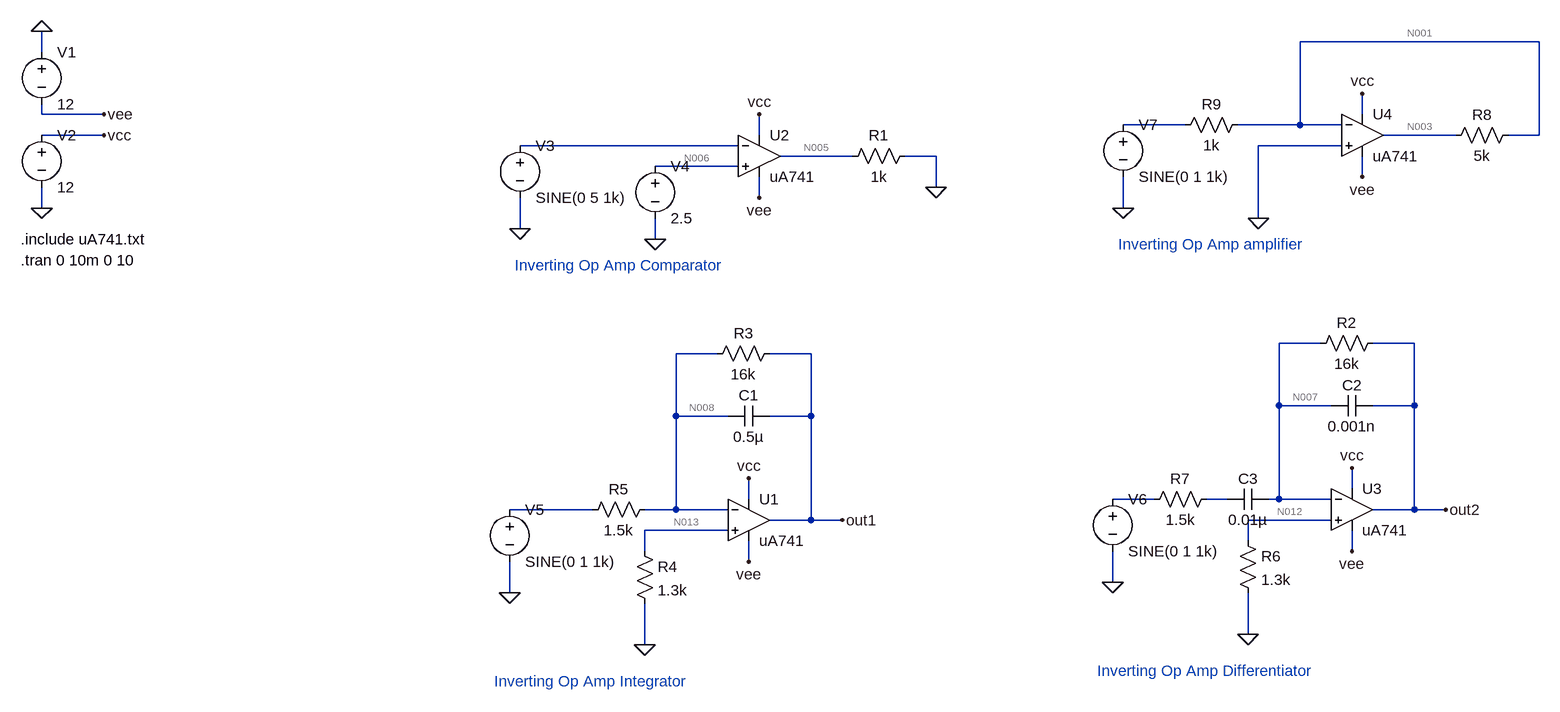
[diagram p0: schematic comparator_amp_diff_integrator.asc]
comparator_amp_diff_integrator.asc, the LTspice schematic file:
Version 4
SHEET 1 1348 1032
WIRE 1328 32 960 32
WIRE -976 48 -976 16
WIRE -976 144 -976 128
WIRE -880 144 -976 144
WIRE 1056 144 1056 112
WIRE 784 160 688 160
WIRE 960 160 960 32
WIRE 960 160 864 160
WIRE 1024 160 960 160
WIRE -880 176 -976 176
WIRE 128 176 128 144
WIRE 1200 176 1088 176
WIRE 1328 176 1328 32
WIRE 1328 176 1280 176
WIRE 96 192 -240 192
WIRE 1024 192 896 192
WIRE 272 208 160 208
WIRE 400 208 352 208
WIRE 96 224 -32 224
WIRE 1056 240 1056 208
WIRE 400 256 400 208
WIRE 128 272 128 240
WIRE -976 288 -976 256
WIRE 688 288 688 240
WIRE 896 304 896 192
WIRE -240 320 -240 272
WIRE -32 336 -32 304
WIRE 992 496 928 496
WIRE 1136 496 1072 496
WIRE 64 512 0 512
WIRE 208 512 144 512
WIRE 928 592 928 496
WIRE 1008 592 928 592
WIRE 1136 592 1136 496
WIRE 1136 592 1072 592
WIRE 0 608 0 512
WIRE 80 608 0 608
WIRE 208 608 208 512
WIRE 208 608 144 608
WIRE 1040 720 1040 688
WIRE 112 736 112 704
WIRE 736 736 672 736
WIRE 848 736 816 736
WIRE 928 736 928 592
WIRE 928 736 912 736
WIRE 1008 736 928 736
WIRE -128 752 -256 752
WIRE 0 752 0 608
WIRE 0 752 -48 752
WIRE 80 752 0 752
WIRE 1136 752 1136 592
WIRE 1136 752 1072 752
WIRE 1184 752 1136 752
WIRE 208 768 208 608
WIRE 208 768 144 768
WIRE 256 768 208 768
WIRE 1008 768 880 768
WIRE 80 784 -48 784
WIRE 880 800 880 768
WIRE -48 816 -48 784
WIRE 1040 816 1040 784
WIRE 112 832 112 800
WIRE 672 864 672 816
WIRE -256 880 -256 832
WIRE 880 944 880 880
WIRE -48 960 -48 896
FLAG -976 288 0
FLAG -976 16 0
FLAG -880 176 vcc
FLAG -880 144 vee
FLAG 128 144 vcc
FLAG 128 272 vee
FLAG 400 256 0
FLAG -240 320 0
FLAG -32 336 0
FLAG 112 704 vcc
FLAG 112 832 vee
FLAG -256 880 0
FLAG -48 960 0
FLAG 256 768 out1
FLAG 1040 688 vcc
FLAG 1040 816 vee
FLAG 672 864 0
FLAG 880 944 0
FLAG 1184 752 out2
FLAG 1056 112 vcc
FLAG 1056 240 vee
FLAG 688 288 0
FLAG 896 304 0
SYMBOL OpAmps\\opamp2 128 144 R0
SYMATTR InstName U2
SYMATTR Value uA741
SYMBOL voltage -976 32 R0
WINDOW 123 0 0 Left 0
WINDOW 39 0 0 Left 0
SYMATTR InstName V1
SYMATTR Value 12
SYMBOL voltage -976 160 R0
WINDOW 123 0 0 Left 0
WINDOW 39 0 0 Left 0
SYMATTR InstName V2
SYMATTR Value 12
SYMBOL voltage -240 176 R0
WINDOW 123 0 0 Left 0
WINDOW 39 0 0 Left 0
SYMATTR InstName V3
SYMATTR Value SINE(0 5 1k)
SYMBOL voltage -32 208 R0
WINDOW 123 0 0 Left 0
WINDOW 39 0 0 Left 0
SYMATTR InstName V4
SYMATTR Value 2.5
SYMBOL res 368 192 R90
WINDOW 0 0 56 VBottom 2
WINDOW 3 32 56 VTop 2
SYMATTR InstName R1
SYMATTR Value 1k
SYMBOL OpAmps\\opamp2 112 704 R0
SYMATTR InstName U1
SYMATTR Value uA741
SYMBOL voltage -256 736 R0
WINDOW 123 0 0 Left 0
WINDOW 39 0 0 Left 0
SYMATTR InstName V5
SYMATTR Value SINE(0 1 1k)
SYMBOL cap 144 592 R90
WINDOW 0 0 32 VBottom 2
WINDOW 3 32 32 VTop 2
SYMATTR InstName C1
SYMATTR Value 0.5µ
SYMBOL res 160 496 R90
WINDOW 0 0 56 VBottom 2
WINDOW 3 32 56 VTop 2
SYMATTR InstName R3
SYMATTR Value 16k
SYMBOL res -64 800 R0
SYMATTR InstName R4
SYMATTR Value 1.3k
SYMBOL res -32 736 R90
WINDOW 0 0 56 VBottom 2
WINDOW 3 32 56 VTop 2
SYMATTR InstName R5
SYMATTR Value 1.5k
SYMBOL OpAmps\\opamp2 1040 688 R0
SYMATTR InstName U3
SYMATTR Value uA741
SYMBOL voltage 672 720 R0
WINDOW 123 0 0 Left 0
WINDOW 39 0 0 Left 0
SYMATTR InstName V6
SYMATTR Value SINE(0 1 1k)
SYMBOL cap 1072 576 R90
WINDOW 0 0 32 VBottom 2
WINDOW 3 32 32 VTop 2
SYMATTR InstName C2
SYMATTR Value 0.001n
SYMBOL res 1088 480 R90
WINDOW 0 0 56 VBottom 2
WINDOW 3 32 56 VTop 2
SYMATTR InstName R2
SYMATTR Value 16k
SYMBOL res 864 784 R0
SYMATTR InstName R6
SYMATTR Value 1.3k
SYMBOL res 832 720 R90
WINDOW 0 0 56 VBottom 2
WINDOW 3 32 56 VTop 2
SYMATTR InstName R7
SYMATTR Value 1.5k
SYMBOL cap 912 720 R90
WINDOW 0 0 32 VBottom 2
WINDOW 3 32 32 VTop 2
SYMATTR InstName C3
SYMATTR Value 0.01µ
SYMBOL OpAmps\\opamp2 1056 112 R0
SYMATTR InstName U4
SYMATTR Value uA741
SYMBOL voltage 688 144 R0
WINDOW 123 0 0 Left 0
WINDOW 39 0 0 Left 0
SYMATTR InstName V7
SYMATTR Value SINE(0 1 1k)
SYMBOL res 1296 160 R90
WINDOW 0 0 56 VBottom 2
WINDOW 3 32 56 VTop 2
SYMATTR InstName R8
SYMATTR Value 5k
SYMBOL res 880 144 R90
WINDOW 0 0 56 VBottom 2
WINDOW 3 32 56 VTop 2
SYMATTR InstName R9
SYMATTR Value 1k
TEXT -1008 368 Left 2 !.tran 0 10m 0 10
TEXT -1008 336 Left 2 !.include uA741.txt
TEXT -248 376 Left 2 ;Inverting Op Amp Comparator
TEXT -280 1016 Left 2 ;Inverting Op Amp Integrator
TEXT 648 1000 Left 2 ;Inverting Op Amp Differentiator
TEXT 680 344 Left 2 ;Inverting Op Amp amplifier

The netlist it stands for:
* comparator_amp_diff_integrator.asc
XU2 N006 N004 vcc vee N005 uA741  ; pins In+ In- V+ V- OUT
V1 0 vee 12
V2 vcc 0 12
V3 N004 0 SINE(0 5 1k)
V4 N006 0 2.5
R1 0 N005 1k
XU1 N013 N008 vcc vee out1 uA741  ; pins In+ In- V+ V- OUT
V5 N011 0 SINE(0 1 1k)
C1 out1 N008 0.5µ
R3 out1 N008 16k
R4 N013 0 1.3k
R5 N008 N011 1.5k
XU3 N012 N007 vcc vee out2 uA741  ; pins In+ In- V+ V- OUT
V6 N009 0 SINE(0 1 1k)
C2 out2 N007 0.001n
R2 out2 N007 16k
R6 N012 0 1.3k
R7 N010 N009 1.5k
C3 N007 N010 0.01µ
XU4 0 N001 vcc vee N003 uA741  ; pins In+ In- V+ V- OUT
V7 N002 0 SINE(0 1 1k)
R8 N001 N003 5k
R9 N001 N002 1k
.tran 0 10m 0 10
.include uA741.txt
* Inverting Op Amp Comparator
* Inverting Op Amp Integrator
* Inverting Op Amp Differentiator
* Inverting Op Amp amplifier
.backanno
.end

* Results of the author's LTspice run, read from the files saved beside the schematic
* Operating Point, zero values left out:
*   V(n005) = 10.01 V
*   V(vee) = -12 V
*   V(vcc) = 12 V
*   V(n006) = 2.5 V
*   V(out1) = 197.3 µV
*   V(n008) = -92.47 µV
*   V(n013) = -103.7 µV
*   V(out2) = 1.184 mV
*   V(n007) = -92.48 µV
*   V(n012) = -103.7 µV
*   V(n003) = 465.9 µV
*   V(n001) = 11.18 µV
*   I(R9) = 11.18 nA
*   I(R8) = -90.94 nA
*   I(R6) = -79.74 nA
*   I(R2) = 79.76 nA
*   I(R5) = -61.65 nA
*   I(R4) = -79.74 nA
*   I(R3) = 18.11 nA
*   I(R1) = -10.01 mA
*   I(V7) = 11.18 nA
*   I(V5) = -61.65 nA
*   I(V4) = -161.5 nA
*   I(V3) = 13.87 pA
*   I(V2) = -5.329 mA
*   I(V1) = -5.342 mA
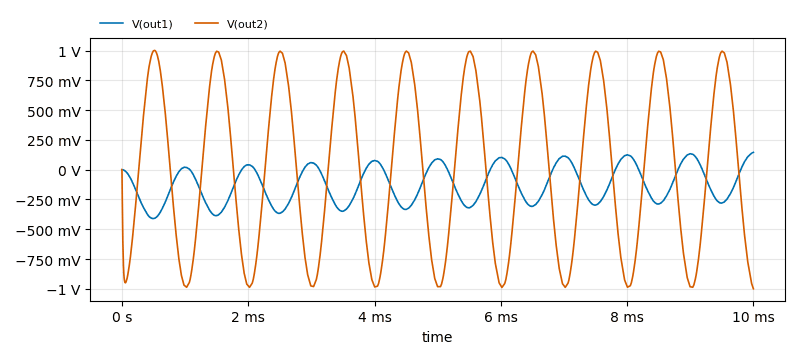
[diagram p1: Transient Analysis of comparator_amp_diff_integrator.asc, plotted from the saved traces]
* Transient Analysis, 1 run:
*   V(out1): min -409.9 mV, max 145.4 mV, average -123.3 mV, rms 196.7 mV, last 145.4 mV
*   V(out2): min -999.7 mV, max 1.002 V, average 3.053 mV, rms 701.1 mV, last -999.7 mV